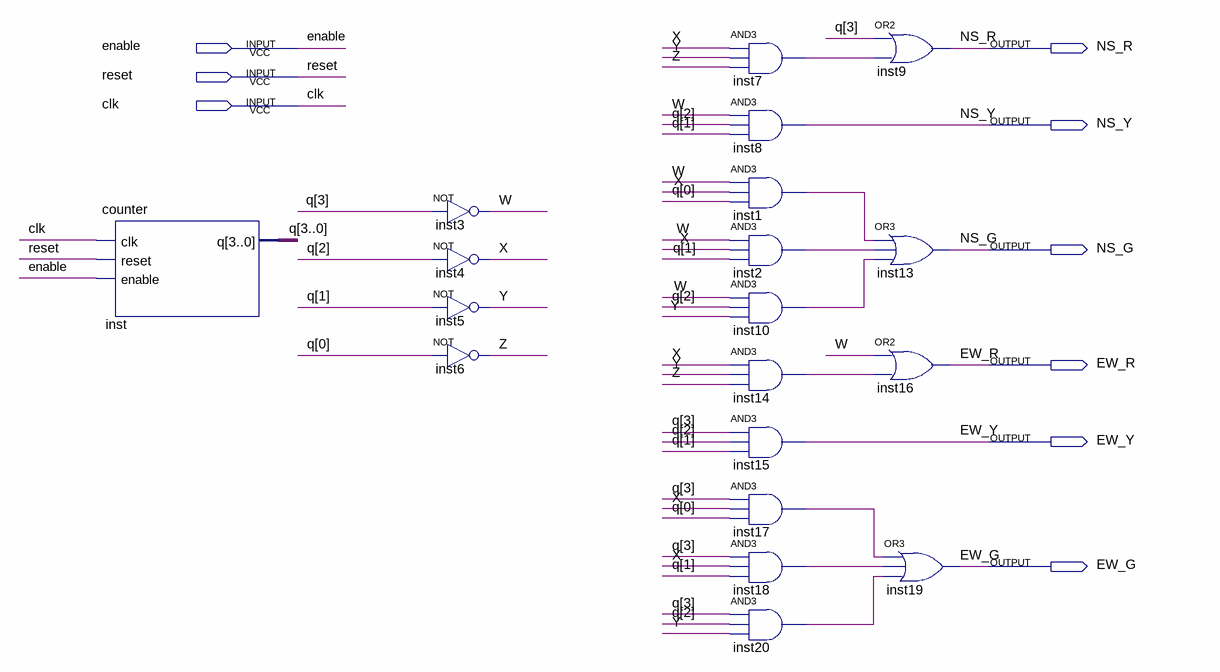
[diagram p0: schematic sheet]
// Quartus schematic traffic.bdf as structural Verilog: 19 symbols, 9 pins
module traffic (
  input  enable,
  input  reset,
  input  clk,
  output NS_R,
  output NS_Y,
  output NS_G,
  output EW_R,
  output EW_Y,
  output EW_G
);

  wire inst1_out, inst2_out, inst7_out, inst10_out, inst14_out, inst17_out, inst18_out, inst20_out, W, X, Y,
       Z;
  wire [3:0] q;

  counter inst (.clk(clk), .reset(reset), .enable(enable), .q(q));
  not inst3 (W, q[3]);
  not inst4 (X, q[2]);
  not inst5 (Y, q[1]);
  not inst6 (Z, q[0]);
  and inst7 (inst7_out, X, Y, Z);
  and inst8 (NS_Y, W, q[2], q[1]);
  and inst1 (inst1_out, W, X, q[0]);
  and inst2 (inst2_out, W, X, q[1]);
  and inst10 (inst10_out, W, q[2], Y);
  and inst14 (inst14_out, X, Y, Z);
  and inst15 (EW_Y, q[3], q[2], q[1]);
  and inst17 (inst17_out, q[3], X, q[0]);
  and inst18 (inst18_out, q[3], X, q[1]);
  and inst20 (inst20_out, q[3], q[2], Y);
  or inst9 (NS_R, q[3], inst7_out);
  or inst13 (NS_G, inst1_out, inst2_out, inst10_out);
  or inst16 (EW_R, W, inst14_out);
  or inst19 (EW_G, inst17_out, inst18_out, inst20_out);
endmodule
